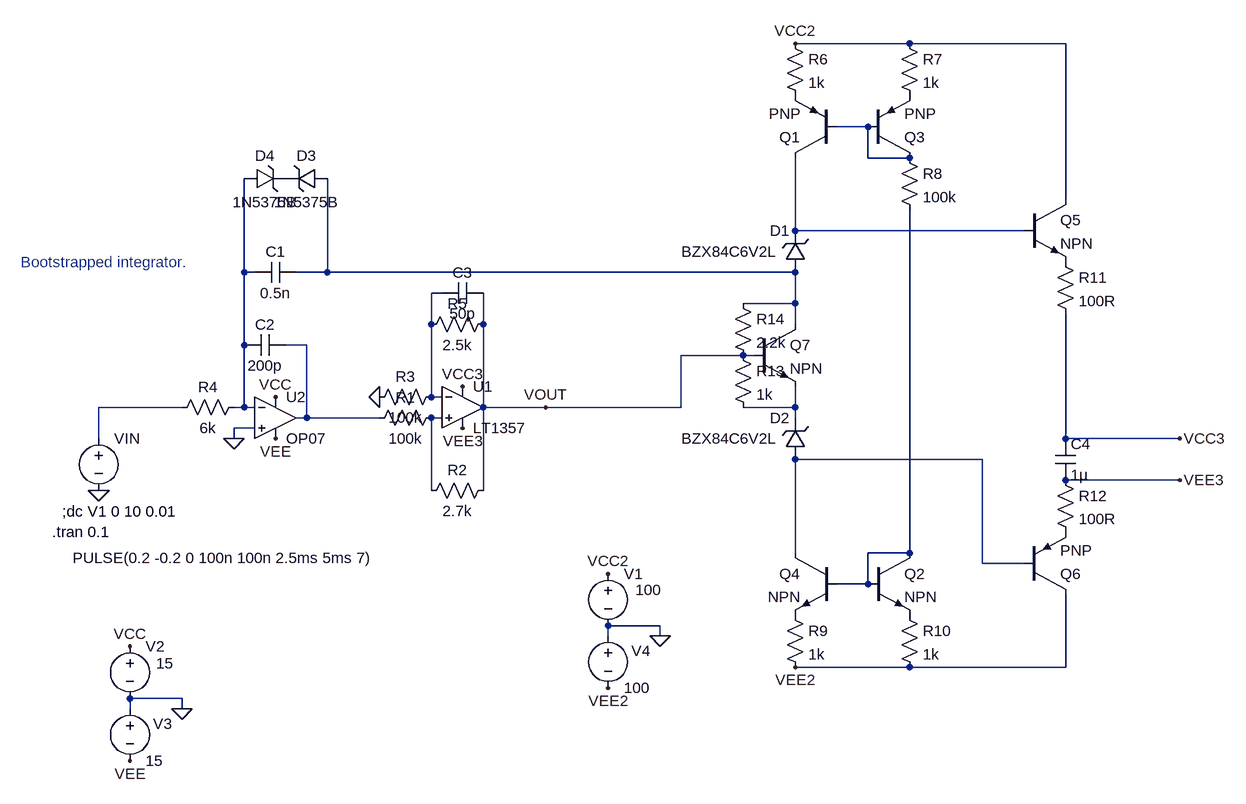
[diagram p0: schematic Draft38.asc]
Draft38.asc, the LTspice schematic file:
Version 4
SHEET 1 1440 868
WIRE 880 -384 704 -384
WIRE 1120 -384 880 -384
WIRE 816 -256 768 -256
WIRE 816 -208 816 -256
WIRE 880 -208 816 -208
WIRE 1120 -144 1120 -384
WIRE 704 -96 704 -208
WIRE 1056 -96 704 -96
WIRE -144 -32 -144 -176
WIRE -128 -32 -144 -32
WIRE -16 -32 -16 -176
WIRE -16 -32 -64 -32
WIRE 704 -32 -16 -32
WIRE 160 0 144 0
WIRE 704 16 704 -32
WIRE 704 16 624 16
WIRE 144 48 144 0
WIRE 224 48 224 0
WIRE 704 48 704 16
WIRE -144 80 -144 -32
WIRE -48 80 -80 80
WIRE 624 96 528 96
WIRE 640 96 624 96
WIRE 144 160 144 48
WIRE 160 160 144 160
WIRE -240 176 -368 176
WIRE -144 176 -144 80
WIRE -144 176 -160 176
WIRE -128 176 -144 176
WIRE 224 176 224 48
WIRE 320 176 224 176
WIRE 528 176 528 96
WIRE 528 176 320 176
WIRE 704 176 704 144
WIRE 704 176 624 176
WIRE -48 192 -48 80
WIRE -48 192 -64 192
WIRE 64 192 -48 192
WIRE 160 192 144 192
WIRE 704 192 704 176
WIRE -128 208 -160 208
WIRE -368 224 -368 176
WIRE -160 224 -160 208
WIRE 1120 224 1120 32
WIRE 1296 224 1120 224
WIRE 992 256 704 256
WIRE 1296 288 1120 288
WIRE 144 304 144 192
WIRE 224 304 224 176
WIRE 704 400 704 256
WIRE 880 400 880 -128
WIRE 880 400 816 400
WIRE 992 416 992 256
WIRE 1056 416 992 416
WIRE 816 448 816 400
WIRE 816 448 768 448
WIRE 496 512 416 512
WIRE 416 528 416 512
WIRE 496 528 496 512
WIRE 880 576 704 576
WIRE 1120 576 1120 464
WIRE 1120 576 880 576
WIRE -240 624 -320 624
WIRE -320 640 -320 624
WIRE -240 640 -240 624
FLAG -368 304 0
FLAG -240 640 0
FLAG 320 176 VOUT
FLAG -160 224 0
FLAG 496 528 0
FLAG 416 432 VCC2
FLAG 416 608 VEE2
FLAG 704 -384 VCC2
FLAG 704 576 VEE2
FLAG 1296 224 VCC3
FLAG 1296 288 VEE3
FLAG -320 544 VCC
FLAG -320 720 VEE
FLAG 192 208 VEE3
FLAG 192 144 VCC3
FLAG 64 160 0
FLAG -96 160 VCC
FLAG -96 224 VEE
SYMBOL voltage -368 208 R0
WINDOW 123 0 0 Left 0
WINDOW 39 0 0 Left 0
WINDOW 3 -40 200 Left 2
SYMATTR Value PULSE(0.2 -0.2 0 100n 100n 2.5ms 5ms 7)
SYMATTR InstName VIN
SYMBOL voltage -320 528 R0
WINDOW 123 0 0 Left 0
WINDOW 39 0 0 Left 0
WINDOW 3 40 42 Left 2
SYMATTR Value 15
SYMATTR InstName V2
SYMBOL voltage -320 624 R0
WINDOW 123 0 0 Left 0
WINDOW 39 0 0 Left 0
WINDOW 0 36 39 Left 2
SYMATTR InstName V3
SYMATTR Value 15
SYMBOL cap -64 -48 R90
WINDOW 0 0 32 VBottom 2
WINDOW 3 32 32 VTop 2
SYMATTR InstName C1
SYMATTR Value 0.5n
SYMBOL res -144 160 R90
WINDOW 0 0 56 VBottom 2
WINDOW 3 32 56 VTop 2
SYMATTR InstName R4
SYMATTR Value 6k
SYMBOL cap -144 96 R270
WINDOW 0 32 32 VTop 2
WINDOW 3 0 32 VBottom 2
SYMATTR InstName C2
SYMATTR Value 200p
SYMBOL pnp 768 -208 R180
SYMATTR InstName Q1
SYMBOL pnp 816 -208 M180
SYMATTR InstName Q3
SYMBOL res 688 -400 R0
SYMATTR InstName R6
SYMATTR Value 1k
SYMBOL res 864 -400 R0
SYMATTR InstName R7
SYMATTR Value 1k
SYMBOL voltage 416 416 R0
WINDOW 123 0 0 Left 0
WINDOW 39 0 0 Left 0
WINDOW 3 42 41 Left 2
SYMATTR Value 100
SYMATTR InstName V1
SYMBOL voltage 416 512 R0
WINDOW 123 0 0 Left 0
WINDOW 39 0 0 Left 0
WINDOW 0 36 39 Left 2
SYMATTR InstName V4
SYMATTR Value 100
SYMBOL npn 816 400 R0
SYMATTR InstName Q2
SYMBOL npn 768 400 M0
SYMATTR InstName Q4
SYMBOL res 864 -224 R0
SYMATTR InstName R8
SYMATTR Value 100k
SYMBOL res 688 480 R0
SYMATTR InstName R9
SYMATTR Value 1k
SYMBOL res 864 480 R0
SYMATTR InstName R10
SYMATTR Value 1k
SYMBOL zener 720 -32 R180
WINDOW 0 24 64 Left 2
WINDOW 3 44 32 Left 2
SYMATTR InstName D1
SYMATTR Value BZX84C6V2L
SYMBOL zener 720 256 R180
WINDOW 0 24 64 Left 2
WINDOW 3 44 32 Left 2
SYMATTR InstName D2
SYMATTR Value BZX84C6V2L
SYMBOL npn 1056 -144 R0
SYMATTR InstName Q5
SYMBOL res 1104 -64 R0
SYMATTR InstName R11
SYMATTR Value 100R
SYMBOL res 1104 272 R0
SYMATTR InstName R12
SYMATTR Value 100R
SYMBOL cap 1104 224 R0
SYMATTR InstName C4
SYMATTR Value 1µ
SYMBOL pnp 1056 464 M180
SYMATTR InstName Q6
SYMBOL res 160 176 R90
WINDOW 0 0 56 VBottom 2
WINDOW 3 32 56 VTop 2
SYMATTR InstName R1
SYMATTR Value 100k
SYMBOL res 240 288 R90
WINDOW 0 0 56 VBottom 2
WINDOW 3 32 56 VTop 2
SYMATTR InstName R2
SYMATTR Value 2.7k
SYMBOL res 160 144 R90
WINDOW 0 0 56 VBottom 2
WINDOW 3 32 56 VTop 2
SYMATTR InstName R3
SYMATTR Value 100k
SYMBOL res 240 32 R90
WINDOW 0 0 56 VBottom 2
WINDOW 3 32 56 VTop 2
SYMATTR InstName R5
SYMATTR Value 2.5k
SYMBOL cap 224 -16 R90
WINDOW 0 0 32 VBottom 2
WINDOW 3 32 32 VTop 2
SYMATTR InstName C3
SYMATTR Value 50p
SYMBOL OpAmps\\OP07 -96 128 R0
SYMATTR InstName U2
SYMBOL zener -144 -160 R270
WINDOW 0 36 32 VTop 2
WINDOW 3 -4 32 VBottom 2
SYMATTR InstName D4
SYMATTR Value 1N5375B
SYMBOL OpAmps\\LT1357 192 112 R0
SYMATTR InstName U1
SYMBOL zener -16 -192 R90
WINDOW 0 -4 32 VBottom 2
WINDOW 3 36 32 VTop 2
SYMATTR InstName D3
SYMATTR Value 1N5375B
SYMBOL npn 640 48 R0
SYMATTR InstName Q7
SYMBOL res 608 80 R0
SYMATTR InstName R13
SYMATTR Value 1k
SYMBOL res 608 0 R0
SYMATTR InstName R14
SYMATTR Value 2.2k
TEXT -424 336 Left 2 !;dc V1 0 10 0.01
TEXT -440 368 Left 2 !.tran 0.1
TEXT -488 -48 Left 2 ;Bootstrapped integrator.

The netlist it stands for:
* Draft38.asc
VIN N007 0 PULSE(0.2 -0.2 0 100n 100n 2.5ms 5ms 7)
V2 VCC 0 15
V3 0 VEE 15
C1 N004 N003 0.5n
R4 N003 N007 6k
C2 N003 N006 200p
Q1 N002 N001 P001 0 PNP
Q3 N001 N001 P002 0 PNP
R6 VCC2 P001 1k
R7 VCC2 P002 1k
V1 VCC2 0 100
V4 0 VEE2 100
Q2 N011 N011 P003 0 NPN
Q4 N010 N011 P004 0 NPN
R8 N001 N011 100k
R9 P004 VEE2 1k
R10 P003 VEE2 1k
D1 N004 N002 BZX84C6V2L
D2 N010 N008 BZX84C6V2L
Q5 VCC2 N002 P005 0 NPN
R11 P005 VCC3 100R
R12 VEE3 P006 100R
C4 VCC3 VEE3 1µ
Q6 VEE2 N010 P006 0 PNP
R1 N009 N006 100k
R2 VOUT N009 2.7k
R3 N005 0 100k
R5 VOUT N005 2.5k
C3 VOUT N005 50p
XU2 0 N003 VCC VEE N006 LT1001  ; OP07, pins In+ In- V+ V- OUT
D4 N003 P007 1N5375B
XU1 N009 N005 VCC3 VEE3 VOUT LT1357  ; pins In+ In- V+ V- OUT
D3 N004 P007 1N5375B
Q7 N004 VOUT N008 0 NPN
R13 VOUT N008 1k
R14 N004 VOUT 2.2k
.model D D
.lib standard.dio
.model NPN NPN
.model PNP PNP
.lib standard.bjt
;dc V1 0 10 0.01
.tran 0.1
* Bootstrapped integrator.
.lib LTC.lib
.backanno
.end

* Results of the author's LTspice run, read from the files saved beside the schematic
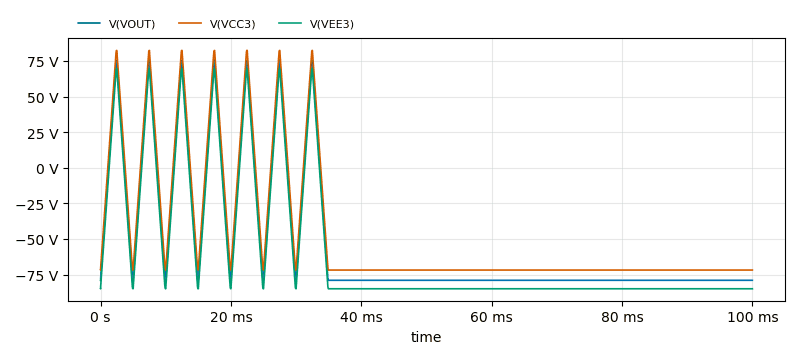
[diagram p1: Transient Analysis of Draft38.asc, plotted from the saved traces]
* Transient Analysis, 1 run:
*   V(VOUT): min -79.07 V, max 75.62 V, average -51.98 V, rms 69.4 V, last -79.04 V
*   V(VCC3): min -71.88 V, max 82.44 V, average -44.86 V, rms 64.16 V, last -71.85 V
*   V(VEE3): min -85.02 V, max 69.49 V, average -57.97 V, rms 73.96 V, last -84.99 V